# Altium project NCLP_PI_v2.PrjPcb
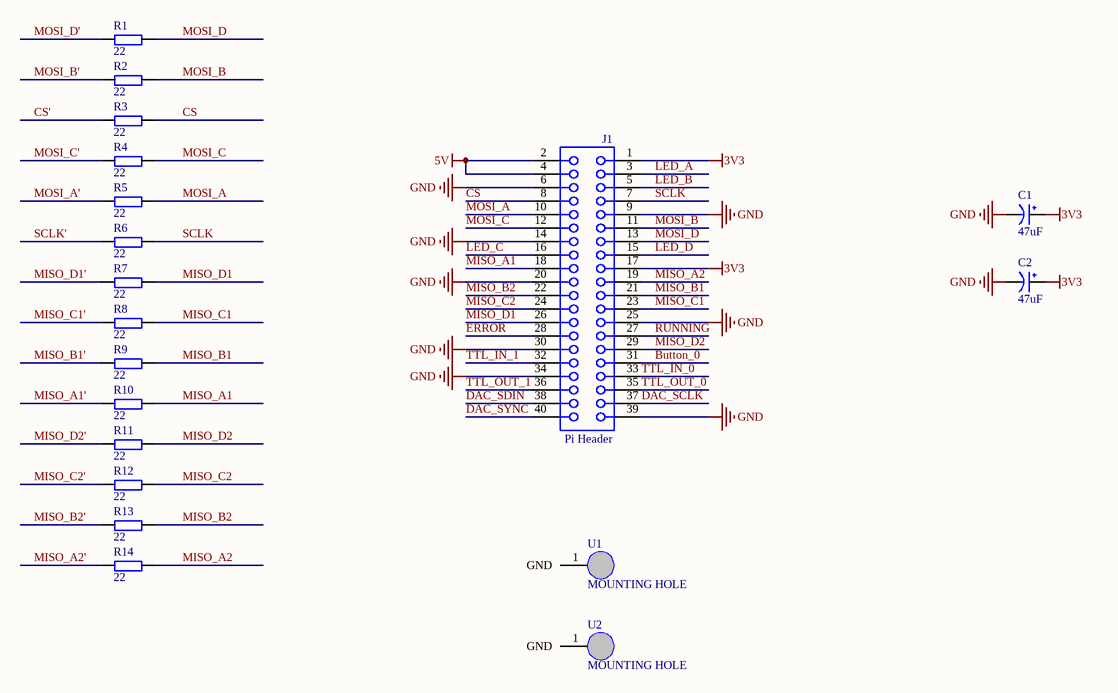
[diagram p0: Header.SchDoc]
6 sheets, 104 parts. Net scope: global (net labels, ports and power ports of the same name join across sheets).
Board file: NCLP_PI_v2.PcbDoc
Sheets:
  Header.SchDoc
  LED_Button.SchDoc
  LVDS_TX.SchDoc
  LVDS_RX.SchDoc
  SMA.SchDoc
  Connectors.SchDoc

## Sheet Header.SchDoc
size A4; SheetNumber: 1; SheetTotal: 6

### Parts
C1  47uF  [CD A(3216)]
C2  47uF  [CD A(3216)]
J1  Pi Header  [61304021821]
R1  22  [R 0402_L]
R2  22  [R 0402_L]
R3  22  [R 0402_L]
R4  22  [R 0402_L]
R5  22  [R 0402_L]
R6  22  [R 0402_L]
R7  22  [R 0402_L]
R8  22  [R 0402_L]
R9  22  [R 0402_L]
R10  22  [R 0402_L]
R11  22  [R 0402_L]
R12  22  [R 0402_L]
R13  22  [R 0402_L]
R14  22  [R 0402_L]
U1  MOUNTING HOLE  [mounting_hole]
U2  MOUNTING HOLE  [mounting_hole]

### Nets
3V3: C1.1(VCC) C2.1(VCC) J1.1 J1.17
5V: J1.2 J1.4
GND: C1.2(GND) C2.2(GND) J1.6 J1.9 J1.14 J1.20 J1.25 J1.30 J1.34 J1.39
Button_0: J1.31
CS: J1.8 R3.2
CS': R3.1
DAC_SCLK: J1.37
DAC_SDIN: J1.38
DAC_SYNC: J1.40
ERROR: J1.28
LED_A: J1.3
LED_B: J1.5
LED_C: J1.16
LED_D: J1.15
MISO_A1: J1.18 R10.2
MISO_A1': R10.1
MISO_A2: J1.19 R14.2
MISO_A2': R14.1
MISO_B1: J1.21 R9.2
MISO_B1': R9.1
MISO_B2: J1.22 R13.2
MISO_B2': R13.1
MISO_C1: J1.23 R8.2
MISO_C1': R8.1
MISO_C2: J1.24 R12.2
MISO_C2': R12.1
MISO_D1: J1.26 R7.2
MISO_D1': R7.1
MISO_D2: J1.29 R11.2
MISO_D2': R11.1
MOSI_A: J1.10 R5.2
MOSI_A': R5.1
MOSI_B: J1.11 R2.2
MOSI_B': R2.1
MOSI_C: J1.12 R4.2
MOSI_C': R4.1
MOSI_D: J1.13 R1.2
MOSI_D': R1.1
RUNNING: J1.27
SCLK: J1.7 R6.2
SCLK': R6.1
TTL_IN_0: J1.33
TTL_IN_1: J1.32
TTL_OUT_0: J1.35
TTL_OUT_1: J1.36

Not connected (* = marked no-connect by the designer): U1 1(GND); U2 1(GND)

### Library data of the parts
C1 C2 = CAP
J1 = CMP-1502-01370-4: THT Vertical Socket Header WR-PHD, Pitch 2.54 mm, Dual Row, 40 pins; Current Rating: 3A; Contact Resistance: 20mΩ; Gender: Female; Operating Supply Voltage: 250V; Lead Pitch: 2.54mm; Orientation: Vertical; Number of Pins: 40
R1-R14 = R
U1 U2 = MountingHole: Part Number: VJ0805Y105KXQRW1BC; Manufacturer: Vitramon

## Sheet LED_Button.SchDoc
size A4; SheetNumber: 2; SheetTotal: 6
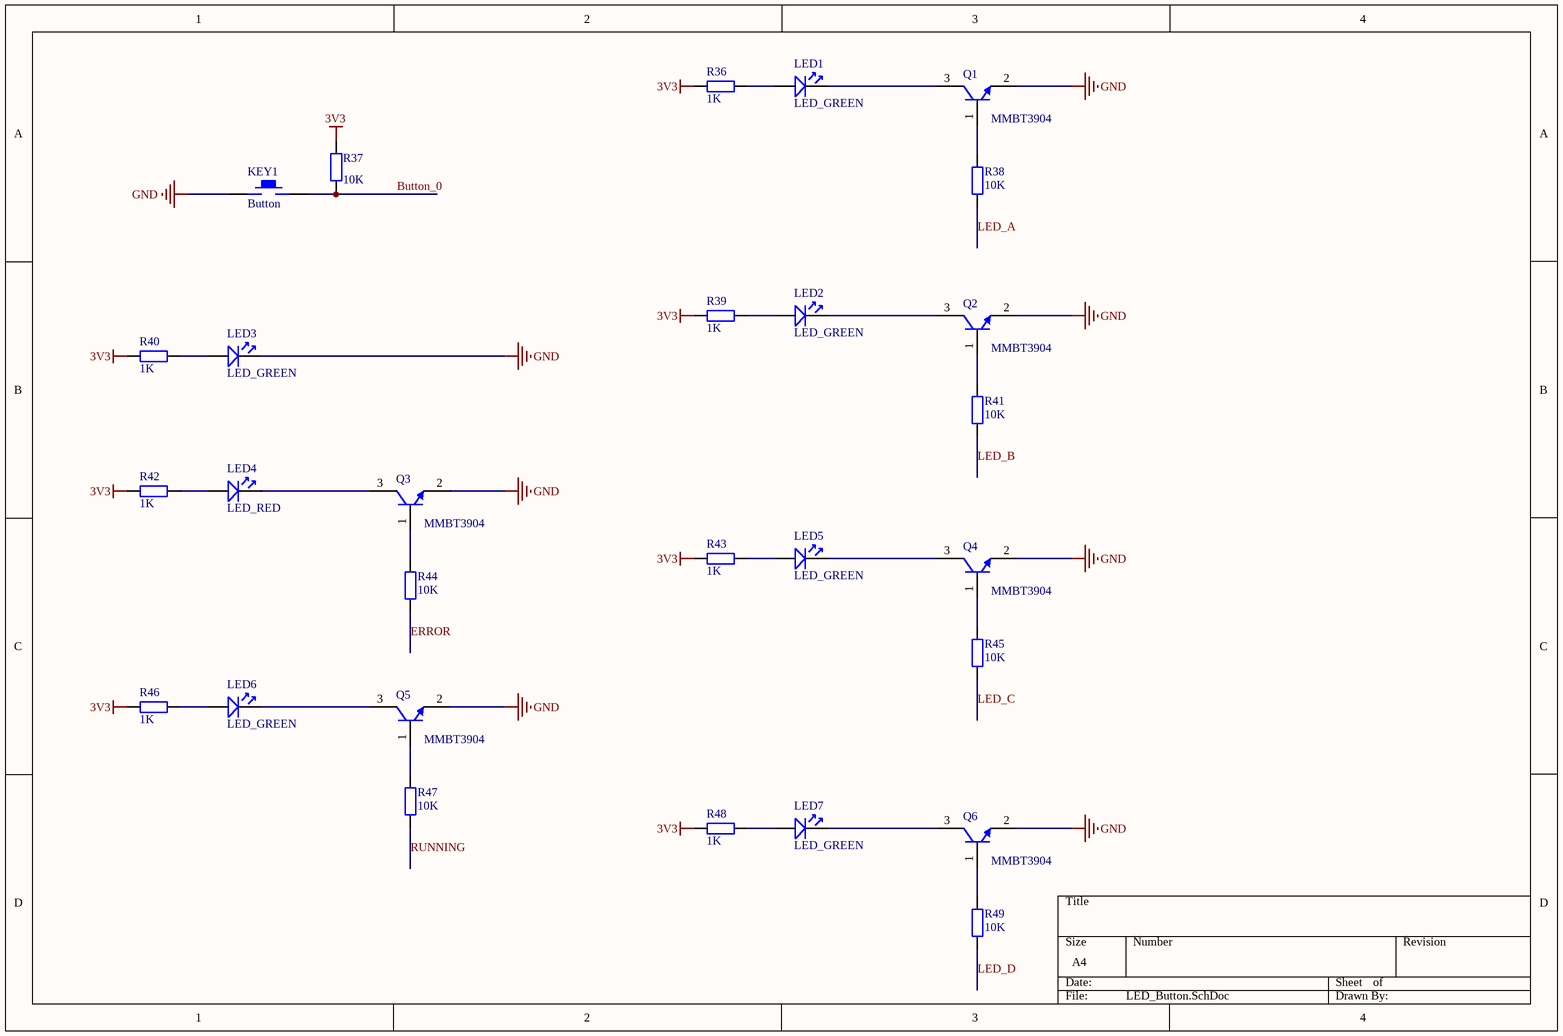
[diagram p1: LED_Button.SchDoc]

### Parts
KEY1  Button  [KEY_SOP324225]
LED1  LED_GREEN  [LED 0603R]
LED2  LED_GREEN  [LED 0603R]
LED3  LED_GREEN  [LED 0603R]
LED4  LED_RED  [LED 0603R]
LED5  LED_GREEN  [LED 0603R]
LED6  LED_GREEN  [LED 0603R]
LED7  LED_GREEN  [LED 0603R]
Q1  MMBT3904  [FAIR-SOT23-3_V]
Q2  MMBT3904  [FAIR-SOT23-3_V]
Q3  MMBT3904  [FAIR-SOT23-3_V]
Q4  MMBT3904  [FAIR-SOT23-3_V]
Q5  MMBT3904  [FAIR-SOT23-3_V]
Q6  MMBT3904  [FAIR-SOT23-3_V]
R36  1K  [R 0402_L]
R37  10K  [R 0402_L]
R38  10K  [R 0402_L]
R39  1K  [R 0402_L]
R40  1K  [R 0402_L]
R41  10K  [R 0402_L]
R42  1K  [R 0402_L]
R43  1K  [R 0402_L]
R44  10K  [R 0402_L]
R45  10K  [R 0402_L]
R46  1K  [R 0402_L]
R47  10K  [R 0402_L]
R48  1K  [R 0402_L]
R49  10K  [R 0402_L]

### Nets
3V3: R36.1 R37.2 R39.1 R40.1 R42.1 R43.1 R46.1 R48.1
GND: KEY1.1 LED3.2 Q1.2(E) Q2.2(E) Q3.2(E) Q4.2(E) Q5.2(E) Q6.2(E)
Button_0: KEY1.2 R37.1
ERROR: R44.1
LED_A: R38.1
LED_B: R41.1
LED_C: R45.1
LED_D: R49.1
RUNNING: R47.1
NetLED1_1: LED1.1 R36.2
NetLED1_2: LED1.2 Q1.3(C)
NetLED2_1: LED2.1 R39.2
NetLED2_2: LED2.2 Q2.3(C)
NetLED3_1: LED3.1 R40.2
NetLED4_1: LED4.1 R42.2
NetLED4_2: LED4.2 Q3.3(C)
NetLED5_1: LED5.1 R43.2
NetLED5_2: LED5.2 Q4.3(C)
NetLED6_1: LED6.1 R46.2
NetLED6_2: LED6.2 Q5.3(C)
NetLED7_1: LED7.1 R48.2
NetLED7_2: LED7.2 Q6.3(C)
NetQ1_1: Q1.1(B) R38.2
NetQ2_1: Q2.1(B) R41.2
NetQ3_1: Q3.1(B) R44.2
NetQ4_1: Q4.1(B) R45.2
NetQ5_1: Q5.1(B) R47.2
NetQ6_1: Q6.1(B) R49.2

### Library data of the parts
KEY1 = KEY_M
LED1-LED7 = LED
Q1-Q6 = CMP-1670-00008-1: NPN General Purpose Amplifier, 40 V, 0.2 A, -55 to 150 degC, 3-Pin SOT23, RoHS, Tape and Reel; Tolerance: 30ppm; Capacitance: 1.8E-11 f; Frequency: 12.288 MHz; ESR: 40 Ohm; Load Capacitance: 18 pF; REACH SVHC: No SVHC; Pins: 4; ComponentLink3URL: http://www.fairchildsemi.com/dwg/MA/MA03D.pdf; PackageDescription: 3-Pin Small Outline Transistor, Body 2.92 x 1.325 mm, Pitch 0.95 mm; ComponentLink1URL: https://www.fairchildsemi.com/; Max Operating Temperature: 70degC; PackageReference: SOT23-3; ComponentLink1Description: Manufacturer URL; Width: 0.126 inch; Min Operating Temperature: -20degC; DatasheetVersion: Rev. 1.1.0, 10/2014; Mount: Surface Mount; Height: 0.041 inch; Package Quantity: 1000; Frequency Tolerance: 30ppm; Packaging: Tape and Reel; ComponentLink2URL: https://www.fairchildsemi.com/datasheets/MM/MMBT3904.pdf; RoHSCompliant: True; ComponentLink3Description: Package Specification; ComponentLink2Description: Datasheet; Length: 0.197 inch
R36-R49 = R_1: 贴片电阻; 版权归属: 源创客; BOM名称: 贴片电阻; 学习资源: www.ooocke.com

## Sheet LVDS_TX.SchDoc
size A4; SheetNumber: 3; SheetTotal: 6
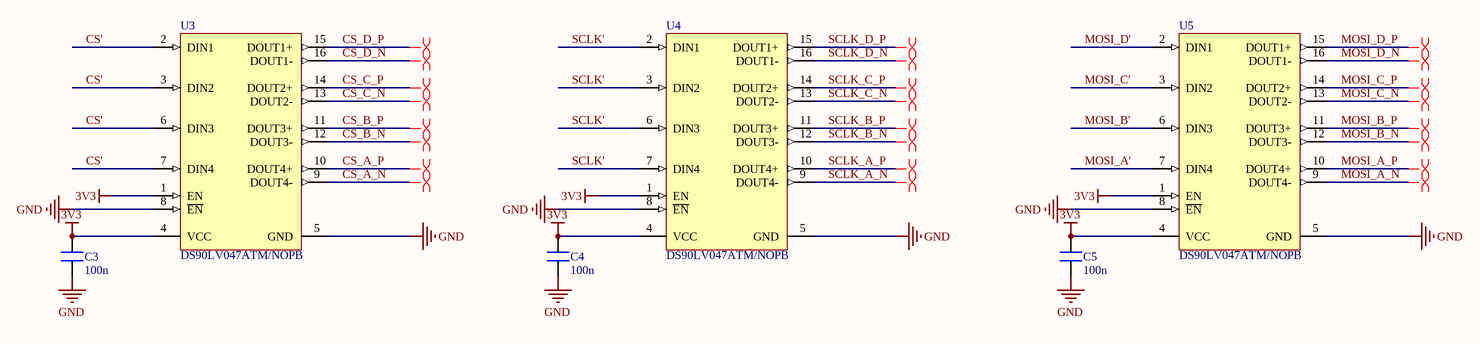
[diagram p2: LVDS_TX.SchDoc]

### Parts
C3  100n  [C 0402_L]
C4  100n  [C 0402_L]
C5  100n  [C 0402_L]
U3  DS90LV047ATM/NOPB  [D0016A_L]
U4  DS90LV047ATM/NOPB  [D0016A_L]
U5  DS90LV047ATM/NOPB  [D0016A_L]

### Nets
3V3: C3.2 C4.2 C5.2 U3.1(EN) U3.4(VCC) U4.1(EN) U4.4(VCC) U5.1(EN) U5.4(VCC)
GND: C3.1 C4.1 C5.1 U3.5(GND) U3.8(~{EN}) U4.5(GND) U4.8(~{EN}) U5.5(GND) U5.8(~{EN})
CS': U3.2(DIN1) U3.3(DIN2) U3.6(DIN3) U3.7(DIN4)
CS_A_N: U3.9(DOUT4-)
CS_A_P: U3.10(DOUT4+)
CS_B_N: U3.12(DOUT3-)
CS_B_P: U3.11(DOUT3+)
CS_C_N: U3.13(DOUT2-)
CS_C_P: U3.14(DOUT2+)
CS_D_N: U3.16(DOUT1-)
CS_D_P: U3.15(DOUT1+)
MOSI_A': U5.7(DIN4)
MOSI_A_N: U5.9(DOUT4-)
MOSI_A_P: U5.10(DOUT4+)
MOSI_B': U5.6(DIN3)
MOSI_B_N: U5.12(DOUT3-)
MOSI_B_P: U5.11(DOUT3+)
MOSI_C': U5.3(DIN2)
MOSI_C_N: U5.13(DOUT2-)
MOSI_C_P: U5.14(DOUT2+)
MOSI_D': U5.2(DIN1)
MOSI_D_N: U5.16(DOUT1-)
MOSI_D_P: U5.15(DOUT1+)
SCLK': U4.2(DIN1) U4.3(DIN2) U4.6(DIN3) U4.7(DIN4)
SCLK_A_N: U4.9(DOUT4-)
SCLK_A_P: U4.10(DOUT4+)
SCLK_B_N: U4.12(DOUT3-)
SCLK_B_P: U4.11(DOUT3+)
SCLK_C_N: U4.13(DOUT2-)
SCLK_C_P: U4.14(DOUT2+)
SCLK_D_N: U4.16(DOUT1-)
SCLK_D_P: U4.15(DOUT1+)

### Layout directives
differential pair: CS_A_N, CS_A_P, CS_B_N, CS_B_P, CS_C_N, CS_C_P, CS_D_N, CS_D_P, MOSI_A_N, MOSI_A_P, MOSI_B_N, MOSI_B_P, MOSI_C_N, MOSI_C_P, MOSI_D_N, MOSI_D_P, SCLK_A_N, SCLK_A_P, SCLK_B_N, SCLK_B_P, SCLK_C_N, SCLK_C_P, SCLK_D_N, SCLK_D_P

### Library data of the parts
C3-C5 = C_1
U3-U5 = CMP-0058-01043-3: 3V LVDS Quad CMOS Differential Line Driver, 16-pin Narrow SOIC, Pb-Free; Manufacturer: Texas Instruments; PowerWise: N; PackageTopMarking: NS2ZXYTTE#*DS90LV047A*TM; CompType: Interface IC; PinCount: 16; RoHS: Y; Code_IPC: SOIC127P600-16; PackageReference: D0016A; ComponentLink1URL: http://www.ti.com/general/docs/lit/getliterature.tsp?genericPartNumber=DS90LV047A&fileType=pdf; Code_JEDEC: MS-012-AC; PackageDescription: Molded Package, SO, .150in Wide, 16 Lead; ComponentLink1Description: Datasheet URL

## Sheet LVDS_RX.SchDoc
size A4; SheetNumber: 4; SheetTotal: 6
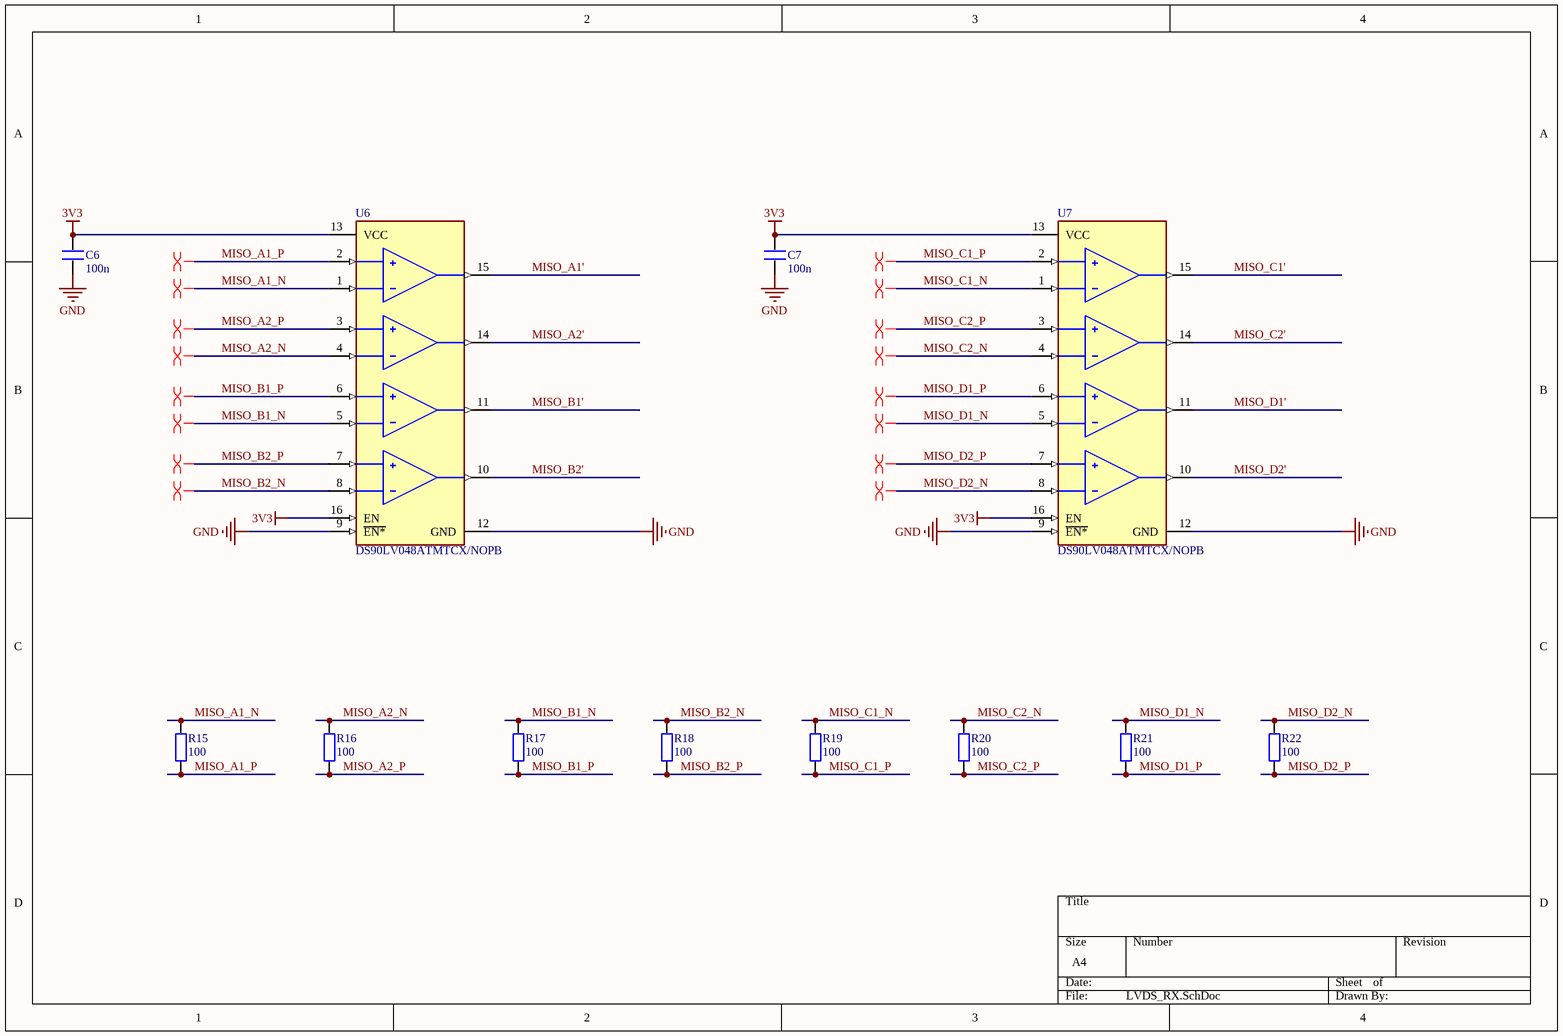
[diagram p3: LVDS_RX.SchDoc]

### Parts
C6  100n  [C 0402_L]
C7  100n  [C 0402_L]
R15  100  [R 0402_L]
R16  100  [R 0402_L]
R17  100  [R 0402_L]
R18  100  [R 0402_L]
R19  100  [R 0402_L]
R20  100  [R 0402_L]
R21  100  [R 0402_L]
R22  100  [R 0402_L]
U6  DS90LV048ATMTCX/NOPB  [FP-PW0016A-MFG]
U7  DS90LV048ATMTCX/NOPB  [FP-PW0016A-MFG]

### Nets
3V3: C6.2 C7.2 U6.13(VCC) U6.16(EN) U7.13(VCC) U7.16(EN)
GND: C6.1 C7.1 U6.9(~{EN*}) U6.12(GND) U7.9(~{EN*}) U7.12(GND)
MISO_A1': U6.15(ROUT1)
MISO_A1_N: R15.2 U6.1(RIN1-)
MISO_A1_P: R15.1 U6.2(RIN1+)
MISO_A2': U6.14(ROUT2)
MISO_A2_N: R16.2 U6.4(RIN2-)
MISO_A2_P: R16.1 U6.3(RIN2+)
MISO_B1': U6.11(ROUT3)
MISO_B1_N: R17.2 U6.5(RIN3-)
MISO_B1_P: R17.1 U6.6(RIN3+)
MISO_B2': U6.10(ROUT4)
MISO_B2_N: R18.2 U6.8(RIN4-)
MISO_B2_P: R18.1 U6.7(RIN4+)
MISO_C1': U7.15(ROUT1)
MISO_C1_N: R19.2 U7.1(RIN1-)
MISO_C1_P: R19.1 U7.2(RIN1+)
MISO_C2': U7.14(ROUT2)
MISO_C2_N: R20.2 U7.4(RIN2-)
MISO_C2_P: R20.1 U7.3(RIN2+)
MISO_D1': U7.11(ROUT3)
MISO_D1_N: R21.2 U7.5(RIN3-)
MISO_D1_P: R21.1 U7.6(RIN3+)
MISO_D2': U7.10(ROUT4)
MISO_D2_N: R22.2 U7.8(RIN4-)
MISO_D2_P: R22.1 U7.7(RIN4+)

### Layout directives
differential pair: MISO_A1_N, MISO_A1_P, MISO_A2_N, MISO_A2_P, MISO_B1_N, MISO_B1_P, MISO_B2_N, MISO_B2_P, MISO_C1_N, MISO_C1_P, MISO_C2_N, MISO_C2_P, MISO_D1_N, MISO_D1_P, MISO_D2_N, MISO_D2_P

### Library data of the parts
C6 C7 = C_1
R15-R22 = R_1: 贴片电阻; 版权归属: 源创客; BOM名称: 贴片电阻; 学习资源: www.ooocke.com
U6 U7 = CMP-04872-000109-1: IC RECEIVER 0/4 16TSSOP; Turn-On Delay Time: 2.7ns; Power Dissipation: 866mW; Number of Receivers: 4; Max Supply Voltage: 3.6V; Min Supply Voltage: 3V; Operating Supply Voltage: 3.3V; Operating Supply Current: 15mA; Min Input Voltage: -100mV; Max Supply Current: 9mA; Data Rate: 400Mbps; Power Consumption: 30W; Max Input Voltage: 0uV; Width: 4.4mm; REACH SVHC: No SVHC; Max Power Dissipation: 866mW; Case/Package: TSSOP; Length: 5mm; Packaging: Tape and Reel; Number of Elements: 4; Package Quantity: 2500; Weight: 0.002222oz; Number of Pins: 16; RoHS Compliant: Yes; Number of Channels: 4; Lead Free: Lead Free; Mount: Surface Mount; Number of Drivers: 4; Height: 0.9mm; Radiation Hardening: No; Logic Function: Receiver; Max Operating Temperature: 85°C; Min Operating Temperature: -40°C; Propagation Delay: 2.7ns

## Sheet SMA.SchDoc
size A4; SheetNumber: 5; SheetTotal: 6
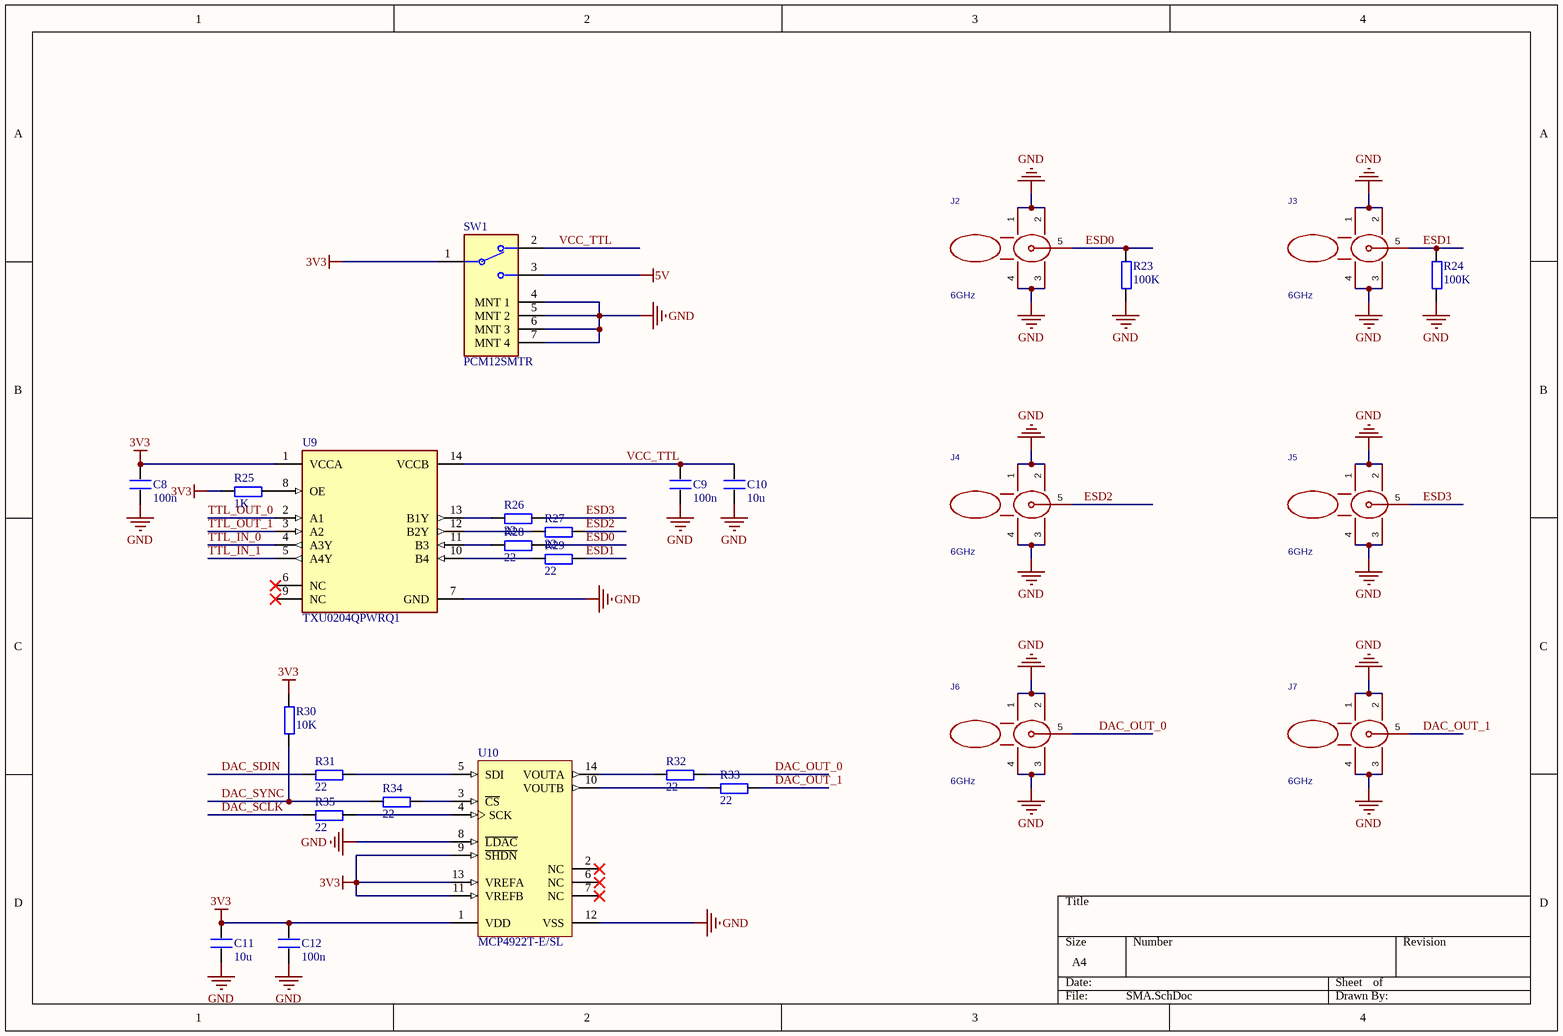
[diagram p4: SMA.SchDoc]

### Parts
C8  100n  [C 0402_L]
C9  100n  [C 0402_L]
C10  10u  [C 0603_L]
C11  10u  [C 0603_L]
C12  100n  [C 0402_L]
J2  6GHz  [PCBComponent_1 - duplicate2]
J3  6GHz  [PCBComponent_1 - duplicate2]
J4  6GHz  [PCBComponent_1 - duplicate2]
J5  6GHz  [PCBComponent_1 - duplicate2]
J6  6GHz  [PCBComponent_1 - duplicate2]
J7  6GHz  [PCBComponent_1 - duplicate2]
R23  100K  [R 0402_L]
R24  100K  [R 0402_L]
R25  1K  [R 0402_L]
R26  22  [R 0402_L]
R27  22  [R 0402_L]
R28  22  [R 0402_L]
R29  22  [R 0402_L]
R30  10K  [R 0402_L]
R31  22  [R 0402_L]
R32  22  [R 0402_L]
R33  22  [R 0402_L]
R34  22  [R 0402_L]
R35  22  [R 0402_L]
SW1  PCM12SMTR  [FP-PCM12SMTR-MFG]
U9  TXU0204QPWRQ1  [FP-PW0014A-MFG]
U10  MCP4922T-E/SL  [SOIC-SL14_M]

### Nets
3V3: C8.2 C11.2 C12.2 R25.1 R30.2 SW1.1 U9.1(VCCA) U10.1(VDD) U10.9(~{SHDN}) U10.11(VREFB) U10.13(VREFA)
5V: SW1.3
GND: C8.1 C9.1 C10.1 C11.1 C12.1 J2.1 J2.2 J2.3 J2.4 J3.1 J3.2 J3.3 J3.4 J4.1 J4.2 J4.3 J4.4 J5.1 J5.2 J5.3 J5.4 J6.1 J6.2 J6.3 J6.4 J7.1 J7.2 J7.3 J7.4 R23.1 R24.1 SW1.4(MNT_1) SW1.5(MNT_2) SW1.6(MNT_3) SW1.7(MNT_4) U9.7(GND) U10.8(~{LDAC}) U10.12(VSS)
DAC_OUT_0: J6.5 R32.2
DAC_OUT_1: J7.5 R33.2
DAC_SCLK: R35.1
DAC_SDIN: R31.1
DAC_SYNC: R30.1 R34.1
ESD0: J2.5 R23.2 R28.2
ESD1: J3.5 R24.2 R29.2
ESD2: J4.5 R27.2
ESD3: J5.5 R26.2
TTL_IN_0: U9.4(A3Y)
TTL_IN_1: U9.5(A4Y)
TTL_OUT_0: U9.2(A1)
TTL_OUT_1: U9.3(A2)
VCC_TTL: C9.2 C10.2 SW1.2 U9.14(VCCB)
NetR25_2: R25.2 U9.8(OE)
NetR26_1: R26.1 U9.13(B1Y)
NetR27_1: R27.1 U9.12(B2Y)
NetR28_1: R28.1 U9.11(B3)
NetR29_1: R29.1 U9.10(B4)
NetR31_2: R31.2 U10.5(SDI)
NetR32_1: R32.1 U10.14(VOUTA)
NetR33_1: R33.1 U10.10(VOUTB)
NetR34_2: R34.2 U10.3(~{CS})
NetR35_2: R35.2 U10.4(SCK)

Not connected (* = marked no-connect by the designer): U9 6(NC)* 9(NC)*; U10 2(NC)* 6(NC)* 7(NC)*

### Library data of the parts
C8-C12 = C_1
J2-J7 = BWSMA-KE-Z001_C496549: Connector Type:Board Side Interface:Inner Bore Number of Ports:1 Interface Diameter:6.2mm Interface Length/Height:- Frequency:6GHz RF Series:SMA Impedance:50Ω Style:Positive Pin Operating Temperature Range:-65℃~+165℃ Operating Temperature Range:-65℃~+165℃; Manufacturer: BAT WIRELESS(蝙蝠无线); AddInBom: yes; ModelId: f6f48ffe9da340b09a5b7cf26dc9292d聨0819f05c4eef4c71ace90d822a990e87; ModelName: SMA-TH_5P-L6.5-W6.5-H9.8_BWSMA-KE-Z001; ModelTransform: 255.905,255.905,0,0,0,0,0,0,-137.795; Number of Ports: 1; Interface Diameter: 6.2mm; RF Series: SMA; Impedance: 50Ω; Symbol: BWSMA-KE-Z001; Device: BWSMA-KE-Z001_C496549; Supplier: LCSC; Supplier Part: C496549; Manufacturer Part: BWSMA-KE-Z001; JLCPCB Part Class: Extended Part; LCSC Part Name: 内孔 SMA 正脚; Supplier Footprint: 插件; Datasheet: https://item.szlcsc.com/datasheet/BWSMA-KE-Z001/508498.html; ConvertToPcb: yes; FootprintName: SMA-TH_BWSMA-KE-Z001; Connector Type: Board Side; Interface: Inner Bore; Interface Length/Height: -; Value: 6GHz; Style: Positive Pin; Operating Temperature Range: -65℃~+165℃
R23-R35 = R
SW1 = CMP-2000-06884-2: SWITCH SLIDE SPDT 300MA 6V; Actuator Material: Nylon; Switch Function: On-On; Insulation Resistance: 100mR; Actuator Type: Standard; Mechanical Life: 10000Cycles; Actuator Length: 1.5mm; Contact Resistance: 70mR; Min Operating Temperature: -20°C; Max Current Rating: 300mA; Max Voltage Rating (DC): 6V; Package Quantity: 1; Mount: Surface Mount; Packaging: Tape and Reel; Contact Plating: Silver; Depth: 5mm; REACH SVHC: No SVHC; Voltage Rating (DC): 6V; Voltage Rating (AC): 6V; Max Operating Temperature: 85°C; Length: 7.7mm; Termination: Gull Wing; Current Rating: 300mA; Contact Current Rating: 300mA; Orientation: Right Angle; Width: 6.7mm; Switch Travel: 1.5mm; Lead Free: Lead Free; Contact Material: Copper Alloy; Throw Configuration: SPDT
U9 = CMP-00370-119764918-1: TXU0204QPWRQ1 Automotive four-channel fixed multidirectional level shifter 14-TSSOP -40 to 125; Manufacturer Lifecycle Status: ACTIVE; Number of Bits: 4; Data Rate: 200Mbps; Propagation Delay: 8ns; Number of Circuits: 1; Nominal Supply Current: 2.5µA; Max Junction Temperature (Tj): 150°C; Case/Package: TSSOP; Length: 5mm; Min Operating Temperature: -40°C; Width: 4.4mm; Number of Inputs: 4; NexarPartId: 119764918; Max Operating Temperature: 125°C; Number of Pins: 14; Lifecycle Status: Production; Number of Outputs: 4; Thickness: 1mm; Ambient Temperature Range High: 125°C; Height: 1.2mm
U10 = CMP-0188-00479-2: 12-Bit DAC with SPI Interface, 14-Pin SOIC 150mil, Extended Temperature, Tape and Reel; ComponentLink2URL: http://ww1.microchip.com/downloads/en/DeviceDoc/22250A.pdf; PackageReference: SOIC-SL14; ComponentLink1URL: http://www.microchip.com/; ComponentLink2Description: Datasheet; RevisionNote: URLs added. DatasheetVersion updated. Sch updated.; ComponentLink3URL: http://www.microchip.com/stellent/groups/techpub_sg/documents/packagingspec/en012702.pdf; PackageVersion: revBB, Aug-2009; ComponentLink1Description: Manufacturer URL; ComponentLink3Description: Package Specification; PackageDescription: 14-Lead Plastic Small Outline (SL) - Narrow, 3.90mm Body [SOIC]; Code_JEDEC: MS-012-AB; Code_IPC: SOIC127P600-14; DatasheetVersion: revA, Apr-2010

## Sheet Connectors.SchDoc
size A4; SheetNumber: 6; SheetTotal: 6
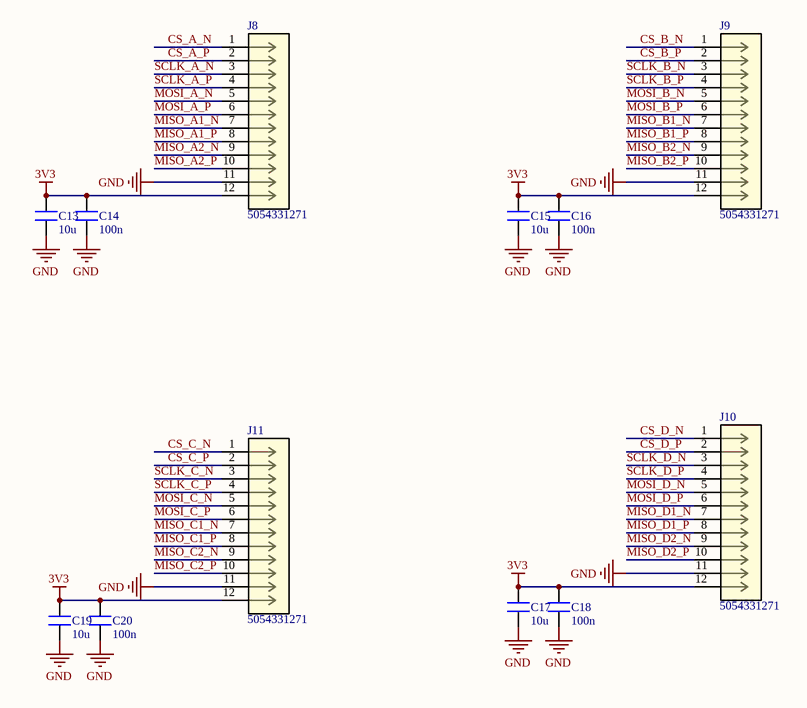
[diagram p5: Connectors.SchDoc]

### Parts
C13  10u  [C 0603_L]
C14  100n  [C 0402_L]
C15  10u  [C 0603_L]
C16  100n  [C 0402_L]
C17  10u  [C 0603_L]
C18  100n  [C 0402_L]
C19  10u  [C 0603_L]
C20  100n  [C 0402_L]
J8  5054331271  [CONN_505433_12_MOL]
J9  5054331271  [CONN_505433_12_MOL]
J10  5054331271  [CONN_505433_12_MOL]
J11  5054331271  [CONN_505433_12_MOL]

### Nets
3V3: C13.2 C14.2 C15.2 C16.2 C17.2 C18.2 C19.2 C20.2 J8.12 J9.12 J10.12 J11.12
GND: C13.1 C14.1 C15.1 C16.1 C17.1 C18.1 C19.1 C20.1 J8.11 J9.11 J10.11 J11.11
CS_A_N: J8.1
CS_A_P: J8.2
CS_B_N: J9.1
CS_B_P: J9.2
CS_C_N: J11.1
CS_C_P: J11.2
CS_D_N: J10.1
CS_D_P: J10.2
MISO_A1_N: J8.7
MISO_A1_P: J8.8
MISO_A2_N: J8.9
MISO_A2_P: J8.10
MISO_B1_N: J9.7
MISO_B1_P: J9.8
MISO_B2_N: J9.9
MISO_B2_P: J9.10
MISO_C1_N: J11.7
MISO_C1_P: J11.8
MISO_C2_N: J11.9
MISO_C2_P: J11.10
MISO_D1_N: J10.7
MISO_D1_P: J10.8
MISO_D2_N: J10.9
MISO_D2_P: J10.10
MOSI_A_N: J8.5
MOSI_A_P: J8.6
MOSI_B_N: J9.5
MOSI_B_P: J9.6
MOSI_C_N: J11.5
MOSI_C_P: J11.6
MOSI_D_N: J10.5
MOSI_D_P: J10.6
SCLK_A_N: J8.3
SCLK_A_P: J8.4
SCLK_B_N: J9.3
SCLK_B_P: J9.4
SCLK_C_N: J11.3
SCLK_C_P: J11.4
SCLK_D_N: J10.3
SCLK_D_P: J10.4

### Library data of the parts
C13 C15 C17 C19 = C_1_8
C14 C16 C18 C20 = C_1
J8-J11 = 5054331271: 1.25mm Pitch, Micro-Lock Plus PCB Header, Dual Row, Vertical, Surface Mount, Tin-Bismuth Plating, Positive Lock, 12 Circuits, Black; Manufacturer_Name: Molex Connector Corporation; Copyright: Copyright (C) 2025 Ultra Librarian. All rights reserved.; Manufacturer_Part_Number: 5054331271; RefDes: RefDes; Type: Type

## Nets that join several sheets
3V3: Header (C1.1 C2.1 J1.1 J1.17), LED_Button (8 pins), LVDS_TX (9 pins), LVDS_RX (6 pins), SMA (11 pins), Connectors (12 pins)
5V: Header (J1.2 J1.4), SMA (SW1.3)
GND: Header (10 pins), LED_Button (8 pins), LVDS_TX (9 pins), LVDS_RX (6 pins), SMA (38 pins), Connectors (12 pins)
Button_0: Header (J1.31), LED_Button (KEY1.2 R37.1)
CS': Header (R3.1), LVDS_TX (U3.2 U3.3 U3.6 U3.7)
CS_A_N: LVDS_TX (U3.9), Connectors (J8.1)
CS_A_P: LVDS_TX (U3.10), Connectors (J8.2)
CS_B_N: LVDS_TX (U3.12), Connectors (J9.1)
CS_B_P: LVDS_TX (U3.11), Connectors (J9.2)
CS_C_N: LVDS_TX (U3.13), Connectors (J11.1)
CS_C_P: LVDS_TX (U3.14), Connectors (J11.2)
CS_D_N: LVDS_TX (U3.16), Connectors (J10.1)
CS_D_P: LVDS_TX (U3.15), Connectors (J10.2)
DAC_SCLK: Header (J1.37), SMA (R35.1)
DAC_SDIN: Header (J1.38), SMA (R31.1)
DAC_SYNC: Header (J1.40), SMA (R30.1 R34.1)
ERROR: Header (J1.28), LED_Button (R44.1)
LED_A: Header (J1.3), LED_Button (R38.1)
LED_B: Header (J1.5), LED_Button (R41.1)
LED_C: Header (J1.16), LED_Button (R45.1)
LED_D: Header (J1.15), LED_Button (R49.1)
MISO_A1': Header (R10.1), LVDS_RX (U6.15)
MISO_A1_N: LVDS_RX (R15.2 U6.1), Connectors (J8.7)
MISO_A1_P: LVDS_RX (R15.1 U6.2), Connectors (J8.8)
MISO_A2': Header (R14.1), LVDS_RX (U6.14)
MISO_A2_N: LVDS_RX (R16.2 U6.4), Connectors (J8.9)
MISO_A2_P: LVDS_RX (R16.1 U6.3), Connectors (J8.10)
MISO_B1': Header (R9.1), LVDS_RX (U6.11)
MISO_B1_N: LVDS_RX (R17.2 U6.5), Connectors (J9.7)
MISO_B1_P: LVDS_RX (R17.1 U6.6), Connectors (J9.8)
MISO_B2': Header (R13.1), LVDS_RX (U6.10)
MISO_B2_N: LVDS_RX (R18.2 U6.8), Connectors (J9.9)
MISO_B2_P: LVDS_RX (R18.1 U6.7), Connectors (J9.10)
MISO_C1': Header (R8.1), LVDS_RX (U7.15)
MISO_C1_N: LVDS_RX (R19.2 U7.1), Connectors (J11.7)
MISO_C1_P: LVDS_RX (R19.1 U7.2), Connectors (J11.8)
MISO_C2': Header (R12.1), LVDS_RX (U7.14)
MISO_C2_N: LVDS_RX (R20.2 U7.4), Connectors (J11.9)
MISO_C2_P: LVDS_RX (R20.1 U7.3), Connectors (J11.10)
MISO_D1': Header (R7.1), LVDS_RX (U7.11)
MISO_D1_N: LVDS_RX (R21.2 U7.5), Connectors (J10.7)
MISO_D1_P: LVDS_RX (R21.1 U7.6), Connectors (J10.8)
MISO_D2': Header (R11.1), LVDS_RX (U7.10)
MISO_D2_N: LVDS_RX (R22.2 U7.8), Connectors (J10.9)
MISO_D2_P: LVDS_RX (R22.1 U7.7), Connectors (J10.10)
MOSI_A': Header (R5.1), LVDS_TX (U5.7)
MOSI_A_N: LVDS_TX (U5.9), Connectors (J8.5)
MOSI_A_P: LVDS_TX (U5.10), Connectors (J8.6)
MOSI_B': Header (R2.1), LVDS_TX (U5.6)
MOSI_B_N: LVDS_TX (U5.12), Connectors (J9.5)
MOSI_B_P: LVDS_TX (U5.11), Connectors (J9.6)
MOSI_C': Header (R4.1), LVDS_TX (U5.3)
MOSI_C_N: LVDS_TX (U5.13), Connectors (J11.5)
MOSI_C_P: LVDS_TX (U5.14), Connectors (J11.6)
MOSI_D': Header (R1.1), LVDS_TX (U5.2)
MOSI_D_N: LVDS_TX (U5.16), Connectors (J10.5)
MOSI_D_P: LVDS_TX (U5.15), Connectors (J10.6)
RUNNING: Header (J1.27), LED_Button (R47.1)
SCLK': Header (R6.1), LVDS_TX (U4.2 U4.3 U4.6 U4.7)
SCLK_A_N: LVDS_TX (U4.9), Connectors (J8.3)
SCLK_A_P: LVDS_TX (U4.10), Connectors (J8.4)
SCLK_B_N: LVDS_TX (U4.12), Connectors (J9.3)
SCLK_B_P: LVDS_TX (U4.11), Connectors (J9.4)
SCLK_C_N: LVDS_TX (U4.13), Connectors (J11.3)
SCLK_C_P: LVDS_TX (U4.14), Connectors (J11.4)
SCLK_D_N: LVDS_TX (U4.16), Connectors (J10.3)
SCLK_D_P: LVDS_TX (U4.15), Connectors (J10.4)
TTL_IN_0: Header (J1.33), SMA (U9.4)
TTL_IN_1: Header (J1.32), SMA (U9.5)
TTL_OUT_0: Header (J1.35), SMA (U9.2)
TTL_OUT_1: Header (J1.36), SMA (U9.3)